# Altium schematic sheet ZMDI-4-V3.SchDoc
size A3
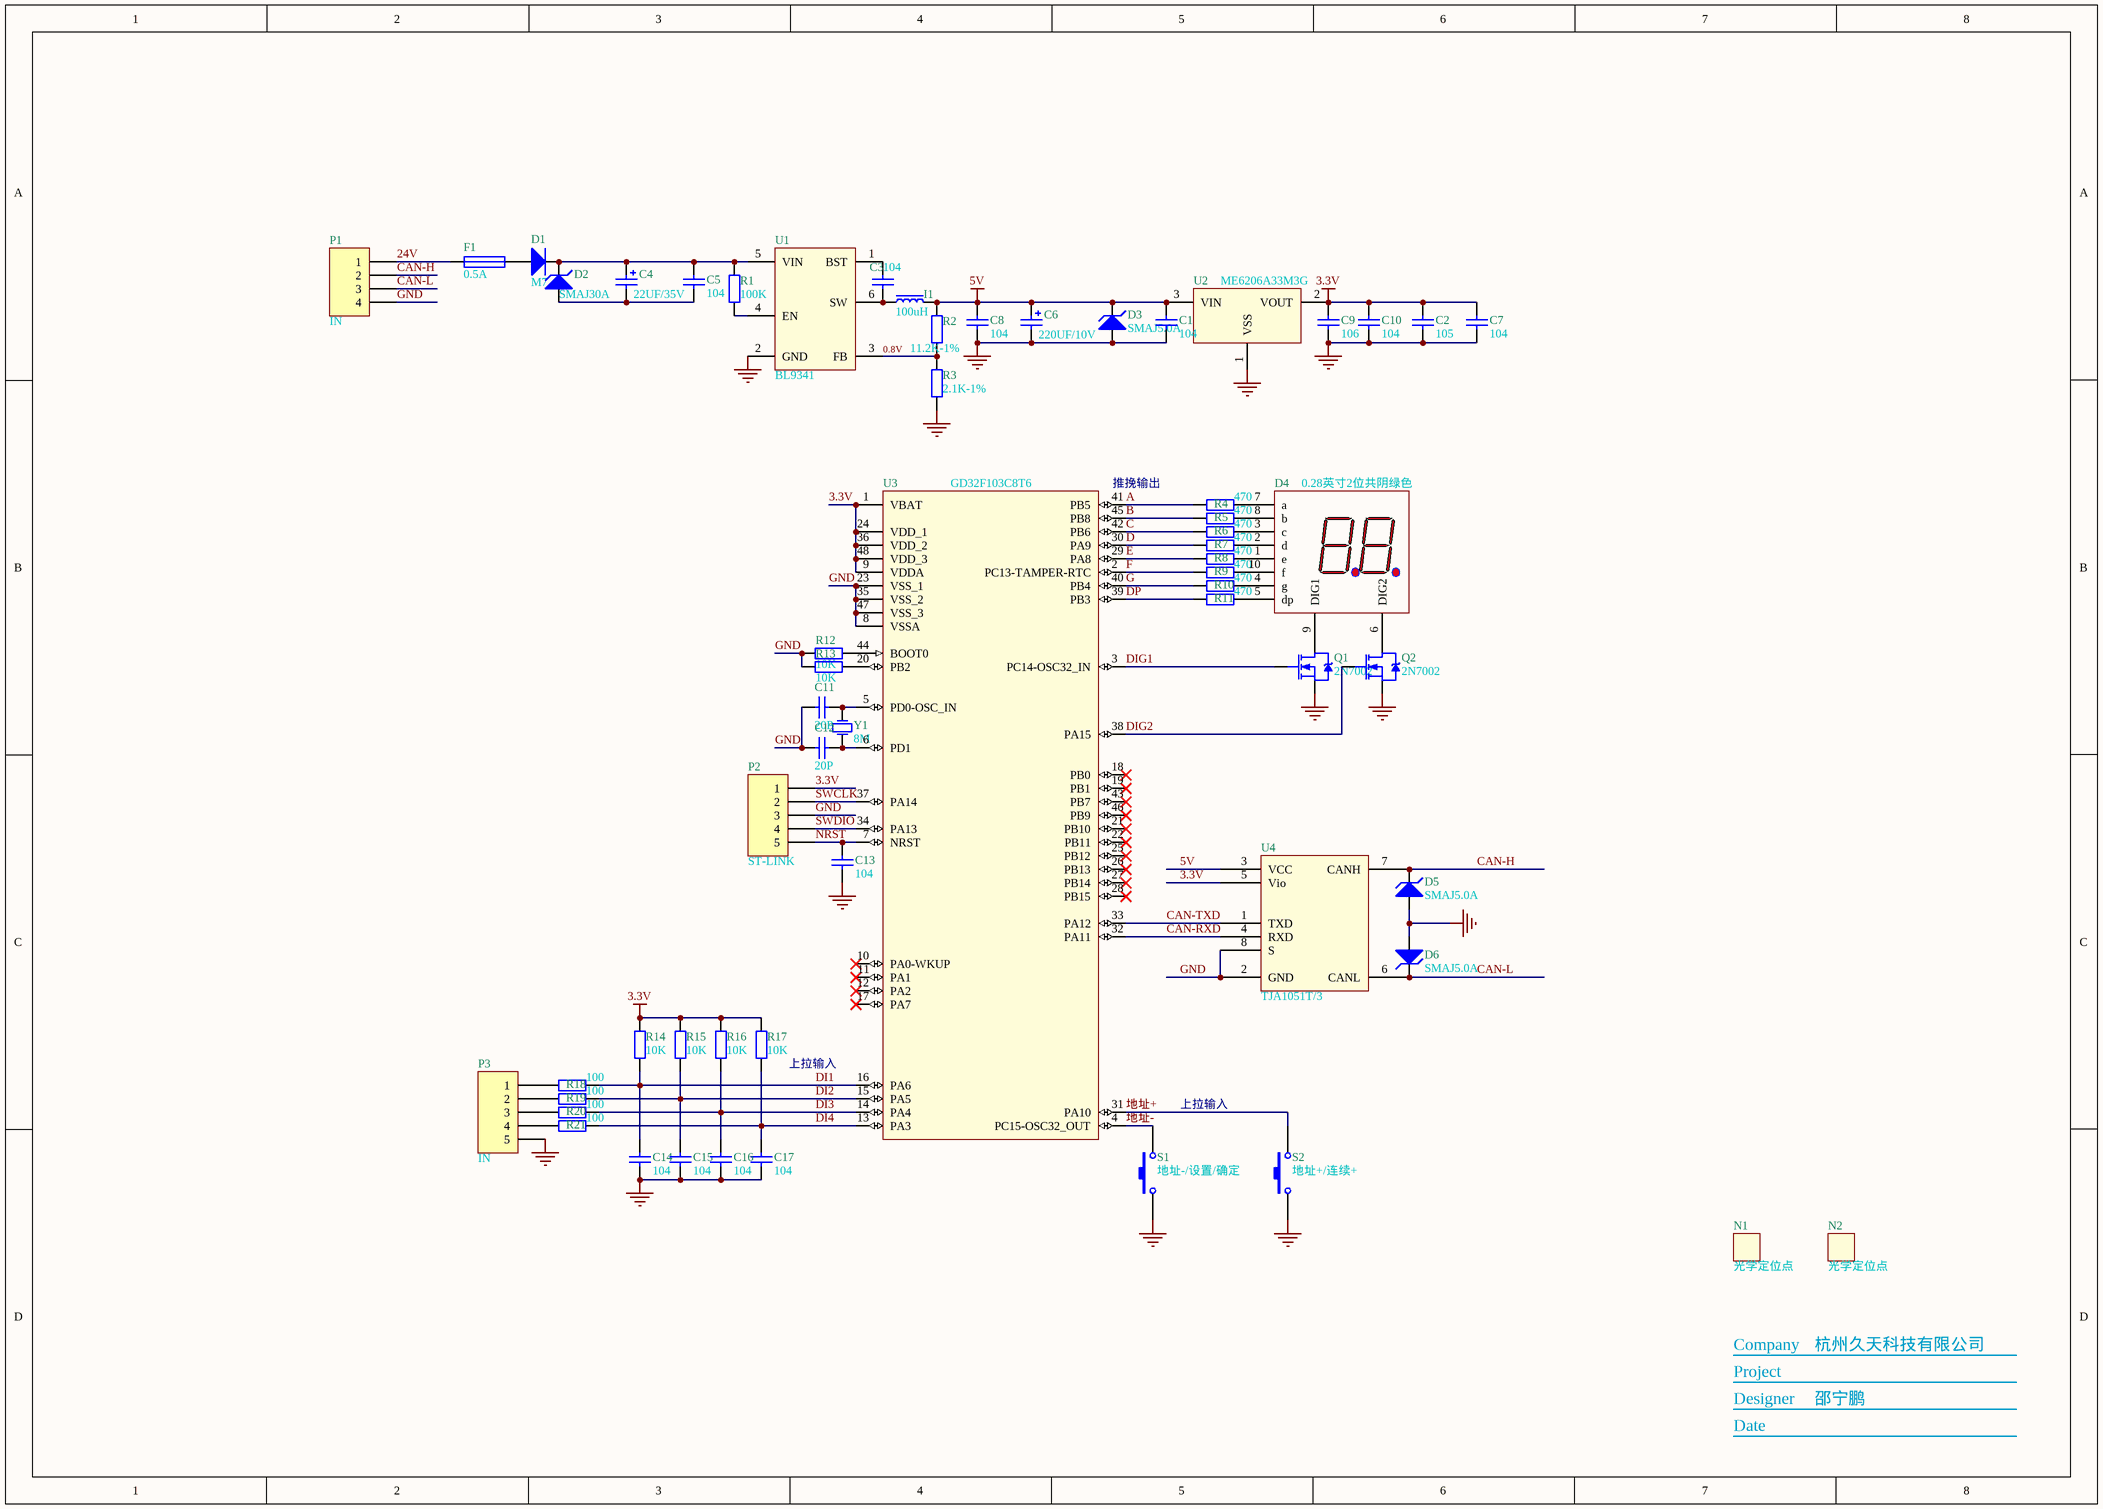
[diagram p0: ZMDI-4-V3.SchDoc]

## Parts
C1  104  [C-0603]
C2  105  [C-0603]
C3  104  [C-0603]
C4  22UF/35V  [贴片固态电容5*5.3]
C5  104  [C-0603]
C6  220UF/10V  [贴片固态电容6.3*5.3-M]
C7  104  [C-0603]
C8  104  [C-0603]
C9  106  [C-0603]
C10  104  [C-0603]
C11  20P  [C-0603]
C12  20P  [C-0603]
C13  104  [C-0603]
C14  104  [C-0603]
C15  104  [C-0603]
C16  104  [C-0603]
C17  104  [C-0603]
D1  M7  [SMA]
D2  SMAJ30A  [SMA]
D3  SMAJ5.0A  [SMA]
D4  0.28英寸2位共阴绿色  [2位0.28英寸]
D5  SMAJ5.0A  [SMA]
D6  SMAJ5.0A  [SMA]
F1  0.5A  [FUSE-1808-N]
I1  100uH  [SWPA4030S]
N1  光学定位点  [MARK-1mm-3mm]
N2  光学定位点  [MARK-1mm-3mm]
P1  IN  [KFEDG-3.5-4P-W]
P2  ST-LINK  [5P下载口]
P3  IN  [XH2.54-5PD]
Q1  2N7002  [SOT-23]
Q2  2N7002  [SOT-23]
R1  100K  [R-0603]
R2  11.2K-1%  [R-0603]
R3  2.1K-1%  [R-0603]
R4  470  [R-0603]
R5  470  [R-0603]
R6  470  [R-0603]
R7  470  [R-0603]
R8  470  [R-0603]
R9  470  [R-0603]
R10  470  [R-0603]
R11  470  [R-0603]
R12  10K  [R-0603]
R13  10K  [R-0603]
R14  10K  [R-0603]
R15  10K  [R-0603]
R16  10K  [R-0603]
R17  10K  [R-0603]
R18  100  [R-0603]
R19  100  [R-0603]
R20  100  [R-0603]
R21  100  [R-0603]
S1  地址-/设置/确定  [SB-4.5*4.5*9-L]
S2  地址+/连续+  [SB-4.5*4.5*9-L]
U1  BL9341  [SOT-23-6-N]
U2  ME6206A33M3G  [SOT-23]
U3  GD32F103C8T6  [LQFP48-L]
U4  TJA1051T/3  [SOP-8-N]
Y1  8M  [HC-49SMD]

## Nets
3.3V: C2.2 C7.2 C9.2 C10.2 P2.1 R14.1 R15.1 R16.1 R17.1 U2.2(VOUT) U3.1(VBAT) U3.9(VDDA) U3.24(VDD_1) U3.36(VDD_2) U3.48(VDD_3) U4.5(Vio)
5V: C1.2 C6.1 C8.2 D3.2(K) I1.2 R2.1 U2.3(VIN) U4.3(VCC)
GND: C1.1 C2.1 C6.2 C7.1 C8.1 C9.1 C10.1 C11.1 C12.1 C13.1 C14.1 C15.1 C16.1 C17.1 D3.1(A) D5.1(A) D6.1(A) P1.4 P2.3 P3.5 Q1.2(S) Q2.2(S) R3.2 R12.2 R13.2 S1.1 S2.1 U1.2(GND) U2.1(VSS) U3.8(VSSA) U3.23(VSS_1) U3.35(VSS_2) U3.47(VSS_3) U4.2(GND) U4.8(S)
0.8V: R2.2 R3.1 U1.3(FB)
24V: F1.1 P1.1
A: R4.1 U3.41(PB5)
B: R5.1 U3.45(PB8)
C: R6.1 U3.42(PB6)
CAN-H: D5.2(K) P1.2 U4.7(CANH)
CAN-L: D6.2(K) P1.3 U4.6(CANL)
CAN-RXD: U3.32(PA11) U4.4(RXD)
CAN-TXD: U3.33(PA12) U4.1(TXD)
D: R7.1 U3.30(PA9)
DI1: C14.2 R14.2 R18.2 U3.16(PA6)
DI2: C15.2 R15.2 R19.2 U3.15(PA5)
DI3: C16.2 R16.2 R20.2 U3.14(PA4)
DI4: C17.2 R17.2 R21.2 U3.13(PA3)
DIG1: Q1.1(G) U3.3(PC14-OSC32_IN)
DIG2: Q2.1(G) U3.38(PA15)
DP: R11.1 U3.39(PB3)
E: R8.1 U3.29(PA8)
F: R9.1 U3.2(PC13-TAMPER-RTC)
G: R10.1 U3.40(PB4)
NRST: C13.2 P2.5 U3.7(NRST)
SWCLK: P2.2 U3.37(PA14)
SWDIO: P2.4 U3.34(PA13)
地址+: S2.2 U3.31(PA10)
地址-: S1.2 U3.4(PC15-OSC32_OUT)
NetC3_1: C3.1 I1.1 U1.6(SW)
NetC3_2: C3.2 U1.1(BST)
NetC4_1: C4.1 C5.2 D1.2(K) D2.2(K) R1.1 U1.5(VIN)
NetC4_2: C4.2 C5.1 D2.1(A)
NetC11_2: C11.2 U3.5(PD0-OSC_IN) Y1.2(OSC2)
NetC12_2: C12.2 U3.6(PD1) Y1.1(OSC1)
NetD1_1: D1.1(A) F1.2
NetD4_1: D4.1(e) R8.2
NetD4_2: D4.2(d) R7.2
NetD4_3: D4.3(c) R6.2
NetD4_4: D4.4(g) R10.2
NetD4_5: D4.5(dp) R11.2
NetD4_6: D4.6(DIG2) Q2.3(D)
NetD4_7: D4.7(a) R4.2
NetD4_8: D4.8(b) R5.2
NetD4_9: D4.9(DIG1) Q1.3(D)
NetD4_10: D4.10(f) R9.2
NetP3_1: P3.1 R18.1
NetP3_2: P3.2 R19.1
NetP3_3: P3.3 R20.1
NetP3_4: P3.4 R21.1
NetR1_2: R1.2 U1.4(EN)
NetR12_1: R12.1 U3.44(BOOT0)
NetR13_1: R13.1 U3.20(PB2)

Not connected (* = marked no-connect by the designer): U3 10(PA0-WKUP)* 11(PA1)* 12(PA2)* 17(PA7)* 18(PB0)* 19(PB1)* 21(PB10)* 22(PB11)* 25(PB12)* 26(PB13)* 27(PB14)* 28(PB15)* 43(PB7)* 46(PB9)*

## Notes on the sheet
- (near U3) 推挽输出
- (near R17) 上拉输入
- (near S1) 上拉输入
- Project
- Company
- 杭州久天科技有限公司
- Designer
- Date
- 邵宁鹏

## Library data of the parts
C1 C3 C5 C8 C14-C17 = Cap: Capacitor; Published: 8-Jun-2000; LatestRevisionDate: 17-Jul-2002; LatestRevisionNote: Re-released for DXP Platform.; PackageReference: RAD-0.3; Publisher: Altium Limited
C2 C7 C9-C13 = Cap-0603: 0805; Published: 8-Jun-2000; LatestRevisionDate: 17-Jul-2002; LatestRevisionNote: Re-released for DXP Platform.; PackageReference: RAD-0.3; Publisher: Altium Limited
C4 C6 = Cap Pol1: Polarized Capacitor (Radial); Published: 8-Jun-2000; LatestRevisionDate: 17-Jul-2002; LatestRevisionNote: Re-released for DXP Platform.; PackageReference: RB7.6-15; Publisher: Altium Limited
D1 = M7: SMA; Published: 8-Jun-2000; LatestRevisionDate: 17-Jul-2002; LatestRevisionNote: Re-released for DXP Platform.; DatasheetVersion: 1989; PackageVersion: 1989; PackageReference: DO-35A; Publisher: Altium Limited; Code_JEDEC: DO-204-AH; ComponentLink1Description: Manufacturer Link; ComponentLink1URL: http://www.national.com/
D2 D3 D5 D6 = TVS-1: SMB
D4 = 2位数码管
F1 = Fuse 1: Fuse; Published: 8-Jun-2000; LatestRevisionDate: 17-Jul-2002; LatestRevisionNote: Re-released for DXP Platform.; PackageReference: PIN-W2/E2.8; Publisher: Altium Limited
I1 = Inductance3
N1 N2 = 无引脚
P1 = Header 4: Header, 4-Pin; LatestRevisionDate: 17-Jul-2002; LatestRevisionNote: Re-released for DXP Platform.; Publisher: Altium Limited
P2 P3 = Header 5: Header, 5-Pin; LatestRevisionDate: 17-Jul-2002; LatestRevisionNote: Re-released for DXP Platform.; Publisher: Altium Limited
R1-R21 = Res2-0603: 0603; Published: 8-Jun-2000; LatestRevisionDate: 17-Jul-2002; LatestRevisionNote: Re-released for DXP Platform.; PackageReference: AXIAL-0.4; Publisher: Altium Limited
S1 S2 = SB-6*6*9: SB-6*6*10; Published: 24-Mar-1999; LatestRevisionDate: 17-Jul-2002; LatestRevisionNote: Re-released for DXP Platform.; PackageReference: SPST-2; Publisher: Altium Limited
U2 = ME6206A33M3G: LDO稳压 SOT-23
Y1 = 晶振